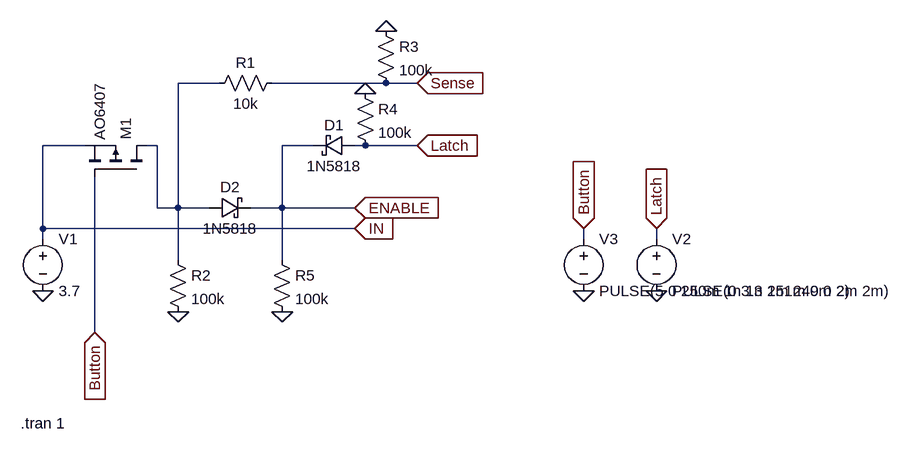
[diagram p0: schematic Power Latch.asc]
Power Latch.asc, the LTspice schematic file:
Version 4
SHEET 1 1148 680
WIRE 64 -80 0 -80
WIRE 320 -80 144 -80
WIRE 368 -80 320 -80
WIRE -144 16 -208 16
WIRE -32 16 -48 16
WIRE 208 16 160 16
WIRE 288 16 272 16
WIRE 368 16 288 16
WIRE -32 112 -32 16
WIRE 0 112 0 -80
WIRE 0 112 -32 112
WIRE 48 112 0 112
WIRE 160 112 160 16
WIRE 160 112 112 112
WIRE 272 112 160 112
WIRE -208 144 -208 16
WIRE 272 144 -208 144
WIRE -208 160 -208 144
WIRE 624 160 624 144
WIRE 736 160 736 144
WIRE 0 192 0 112
WIRE 160 192 160 112
WIRE -128 304 -128 64
FLAG 0 272 0
FLAG -208 240 0
FLAG 272 112 ENABLE
IOPIN 272 112 In
FLAG 272 144 IN
IOPIN 272 144 In
FLAG 368 16 Latch
IOPIN 368 16 In
FLAG 368 -80 Sense
IOPIN 368 -80 In
FLAG 736 240 0
FLAG 736 144 Latch
IOPIN 736 144 In
FLAG -128 304 Button
IOPIN -128 304 In
FLAG 624 240 0
FLAG 624 144 Button
IOPIN 624 144 In
FLAG 288 -64 0
FLAG 320 -160 0
FLAG 160 272 0
SYMBOL schottky 272 0 R90
WINDOW 0 0 32 VBottom 2
WINDOW 3 32 32 VTop 2
SYMATTR InstName D1
SYMATTR Value 1N5818
SYMATTR Description Diode
SYMATTR Type diode
SYMBOL schottky 48 128 R270
WINDOW 0 32 32 VTop 2
WINDOW 3 0 32 VBottom 2
SYMATTR InstName D2
SYMATTR Value 1N5818
SYMATTR Description Diode
SYMATTR Type diode
SYMBOL res 160 -96 R90
WINDOW 0 0 56 VBottom 2
WINDOW 3 32 56 VTop 2
SYMATTR InstName R1
SYMATTR Value 10k
SYMBOL res -16 176 R0
SYMATTR InstName R2
SYMATTR Value 100k
SYMBOL voltage -208 144 R0
WINDOW 123 0 0 Left 0
WINDOW 39 0 0 Left 0
SYMATTR InstName V1
SYMATTR Value 3.7
SYMBOL voltage 736 144 R0
WINDOW 123 0 0 Left 0
WINDOW 39 0 0 Left 0
SYMATTR InstName V2
SYMATTR Value PULSE(0 3.3 251m 0 0 2m 2m)
SYMBOL pmos -48 64 M270
SYMATTR InstName M1
SYMATTR Value AO6407
SYMBOL voltage 624 144 R0
WINDOW 123 0 0 Left 0
WINDOW 39 0 0 Left 0
SYMATTR InstName V3
SYMATTR Value PULSE(5 0 250m 1n 1n 1m 249m 2)
SYMBOL res 304 -176 R0
SYMATTR InstName R3
SYMATTR Value 100k
SYMBOL res 272 -80 R0
SYMATTR InstName R4
SYMATTR Value 100k
SYMBOL res 144 176 R0
SYMATTR InstName R5
SYMATTR Value 100k
TEXT -242 444 Left 2 !.tran 1

The netlist it stands for:
* Power Latch.asc
D1 Latch ENABLE 1N5818
D2 N001 ENABLE 1N5818
R1 Sense N001 10k
R2 N001 0 100k
V1 IN 0 3.7
V2 Latch 0 PULSE(0 3.3 251m 0 0 2m 2m)
M1 N001 Button IN IN AO6407
V3 Button 0 PULSE(5 0 250m 1n 1n 1m 249m 2)
R3 0 Sense 100k
R4 0 Latch 100k
R5 ENABLE 0 100k
.model D D
.lib standard.dio
.model NMOS NMOS
.model PMOS PMOS
.lib standard.mos
.tran 1
.backanno
.end